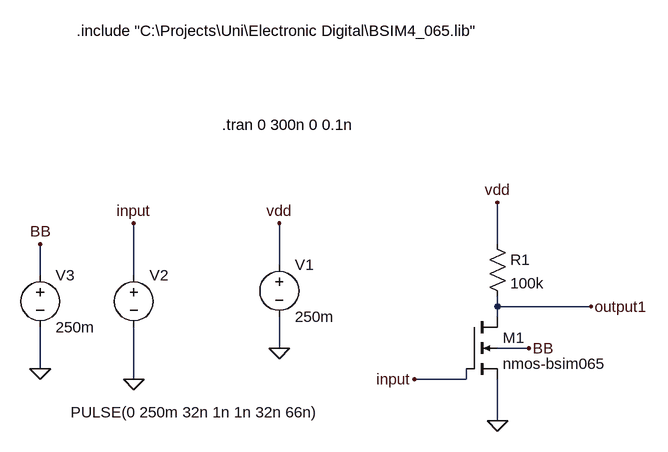
[diagram p0: schematic Resistive-Load NMOS Inverter.asc]
Resistive-Load NMOS Inverter.asc, the LTspice schematic file:
Version 4.1
SHEET 1 1216 796
WIRE 400 64 400 0
WIRE 64 96 64 32
WIRE -304 112 -304 64
WIRE -160 112 -160 32
WIRE 400 160 400 144
WIRE 544 160 400 160
WIRE 400 176 400 160
WIRE 64 224 64 176
WIRE 448 224 400 224
WIRE -304 256 -304 192
WIRE -160 272 -160 192
WIRE 352 272 352 256
WIRE 352 272 272 272
WIRE 400 336 400 272
FLAG 400 336 0
FLAG 64 224 0
FLAG 64 32 vdd
FLAG 400 0 vdd
FLAG 272 272 input
FLAG 544 160 output1
FLAG -160 272 0
FLAG -160 32 input
FLAG -304 256 0
FLAG -304 64 BB
FLAG 448 224 BB
SYMBOL res 384 48 R0
SYMATTR InstName R1
SYMATTR Value 100k
SYMBOL voltage 64 80 R0
WINDOW 123 0 0 Left 0
WINDOW 39 0 0 Left 0
SYMATTR InstName V1
SYMATTR Value 250m
SYMBOL voltage -160 96 R0
WINDOW 3 -97 227 Left 2
WINDOW 123 0 0 Left 0
WINDOW 39 0 0 Left 0
SYMATTR Value PULSE(0 250m 32n 1n 1n 32n 66n)
SYMATTR InstName V2
SYMBOL nmos4 352 176 R0
SYMATTR InstName M1
SYMATTR Value nmos-bsim065
SYMATTR Value2 l=65n w=140n
SYMBOL voltage -304 96 R0
WINDOW 123 0 0 Left 0
WINDOW 39 0 0 Left 0
SYMATTR InstName V3
SYMATTR Value 250m
TEXT -24 -120 Left 2 !.tran 0 300n 0 0.1n
TEXT -248 -264 Left 2 !.include "C:\\Projects\\Uni\\Electronic Digital\\BSIM4_065.lib"

The netlist it stands for:
* Resistive-Load NMOS Inverter.asc
R1 vdd output1 100k
V1 vdd 0 250m
V2 input 0 PULSE(0 250m 32n 1n 1n 32n 66n)
M1 output1 input 0 BB nmos-bsim065 l=65n w=140n
V3 BB 0 250m
.model NMOS NMOS
.model PMOS PMOS
.lib standard.mos
.tran 0 300n 0 0.1n
.include "C:\Projects\Uni\Electronic Digital\BSIM4_065.lib"
.backanno
.end

* Results of the author's LTspice run, read from the files saved beside the schematic
* Operating Point, zero values left out:
*   V(bb) = 250 mV
*   V(output1) = 201.6 mV
*   V(vdd) = 250 mV
*   I(R1) = 484 nA
*   I(V1) = -484 nA
*   Id(M1) = 484 nA
*   Is(M1) = -484 nA
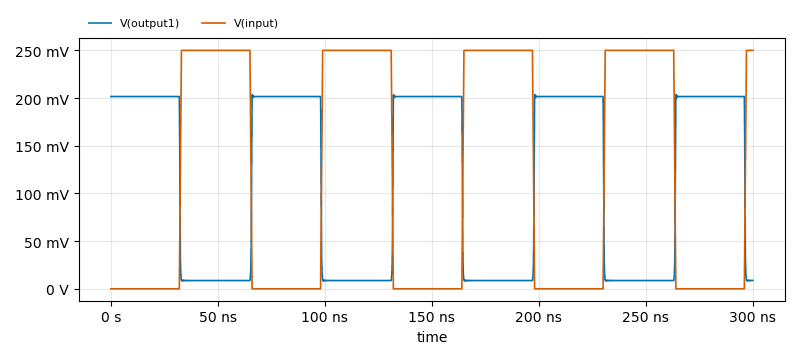
[diagram p1: Transient Analysis of Resistive-Load NMOS Inverter.asc, plotted from the saved traces]
* Transient Analysis, 1 run:
*   V(output1): min 8.574 mV, max 203.6 mV, average 113.3 mV, rms 148.2 mV, last 8.709 mV
*   V(input): min 0 V, max 250 mV, average 112.9 mV, rms 167.1 mV, last 250 mV